# Altium schematic sheet P03 Power Tree.SchDoc
size 297 x 209 mm
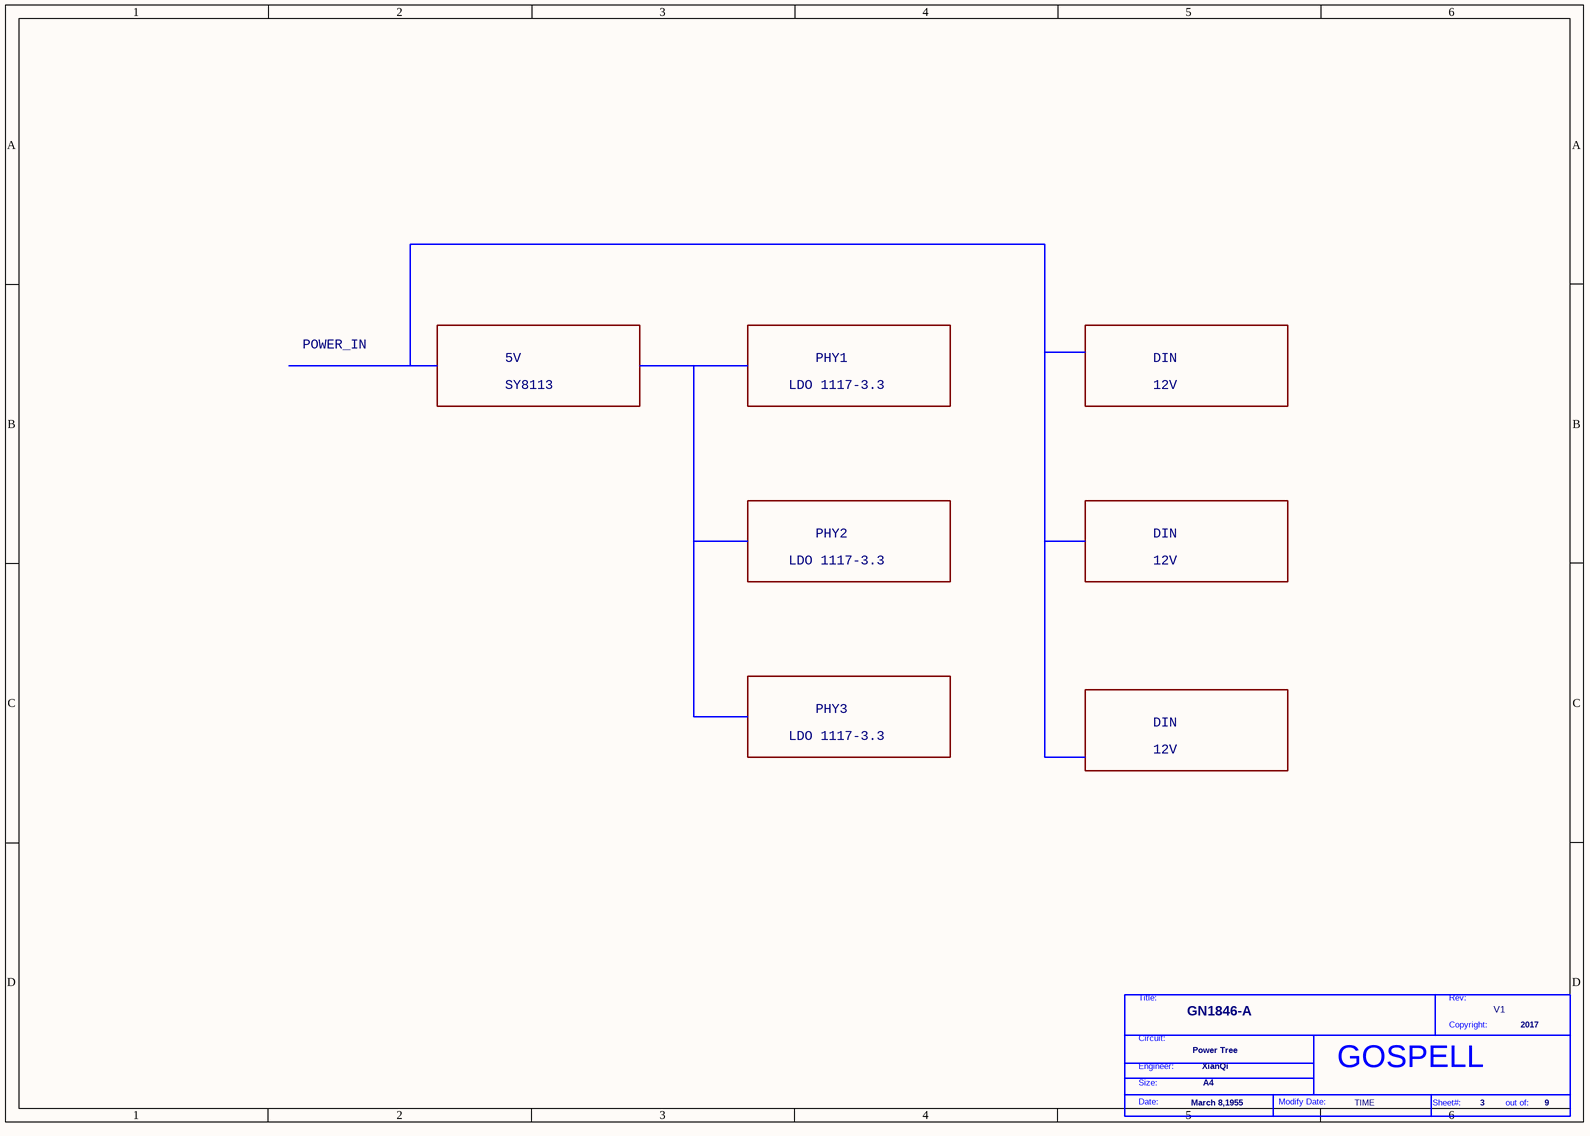
[diagram p0: P03 Power Tree.SchDoc]

## Parts
*  Doc: Power Tree  Page Count: 9  Page Number: 3  Page Create Date: March 8,1955  Page Size: A4  RevCode: V1  Title: GN1846-A  Copyright: 2017  Engineer: XianQi  Page Modify Date: TIME  (hidden comment: GOSPELL)  (graphical)

## Notes on the sheet
- POWER_IN
- 5V
- SY8113
- LDO 1117-3.3
- PHY1
- DIN
- 12V
- PHY2
- PHY3
- (in symbol GOSPELL) Title:; Rev:; Copyright:; Circuit:; Engineer:; Size:; Date:; Modify Date:; Sheet#:; out of:

## Library data of the parts
* = GOSPELL: Cage Code: 2017; Schematic Page Count: 9; Schematic Page Number: 3